# Altium schematic sheet RPIPICOW.SchDoc
size A4; SheetNumber: 5; SheetTotal: 8
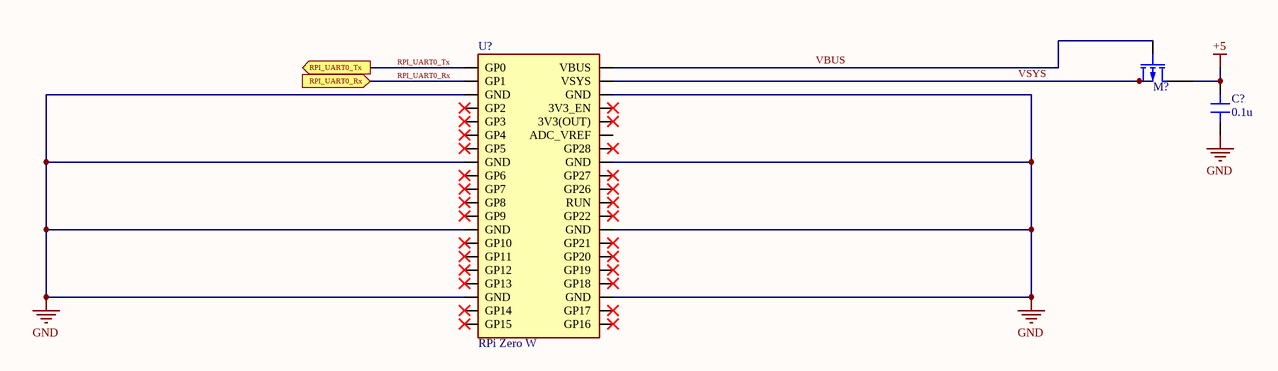
[diagram p0: RPIPICOW.SchDoc]

## Parts
C?  0.1u
M?  P-channel MOS1 MOSFET Shichman and Hodges Model  (value not drawn)
U?  RPi Zero W  [PICO_W]

## Ports
RPI_UART0_Rx (in), RPI_UART0_Tx (out)

## Nets
+5: C?.2 M?.1(D)
GND: C?.1 U?.3(GND) U?.8(GND) U?.13(GND) U?.18(GND) U?.23(GND) U?.28(GND) U?.33(GND) U?.38(GND)
RPI_UART0_Rx: U?.22(GP1) ; port RPI_UART0_Rx
RPI_UART0_Tx: U?.21(GP0) ; port RPI_UART0_Tx
VBUS: M?.2(G) U?.20(VBUS)
VSYS: M?.3(S) M?.4(B) U?.19(VSYS)

Not connected (* = marked no-connect by the designer): U? 1(GP16)* 2(GP17)* 4(GP18)* 5(GP19)* 6(GP20)* 7(GP21)* 9(GP22)* 10(RUN)* 11(GP26)* 12(GP27)* 14(GP28)* 15(ADC_VREF) 16(3V3(OUT))* 17(3V3_EN)* 24(GP2)* 25(GP3)* 26(GP4)* 27(GP5)* 29(GP6)* 30(GP7)* 31(GP8)* 32(GP9)* 34(GP10)* 35(GP11)* 36(GP12)* 37(GP13)* 39(GP14)* 40(GP15)*

## Library data of the parts
C? = Capacitor: Value: *; HelpURL: *; MPN: *; Supplier: *; SupplierPartNumber: *
M? = MOSFET P-ch Lev1: CBD: 0; FC: 0.5; IS: 1e-14; KP: 2e-05; PB: 0.8; PHI: 0.6; TNOM: 27; SimulationGenericComponent: True; CBS: 0; CGBO: 0; CGDO: 0; CGSO: 0; CJ: 0; CJSW: 0; GAMMA: 0; JS: 0; LAMBDA: 0; LD: 0; MJ: 0.5; MJSW: 0.5; NSS: 0; NSUB: 0; RD: 0; RS: 0; RSH: 0; TOX: 0; TPG: 0; U0: 0; VTO: 0
U? = PICO_W: Value: *; HelpURL: *; MPN: *; Supplier: *; SupplierPartNumber: *